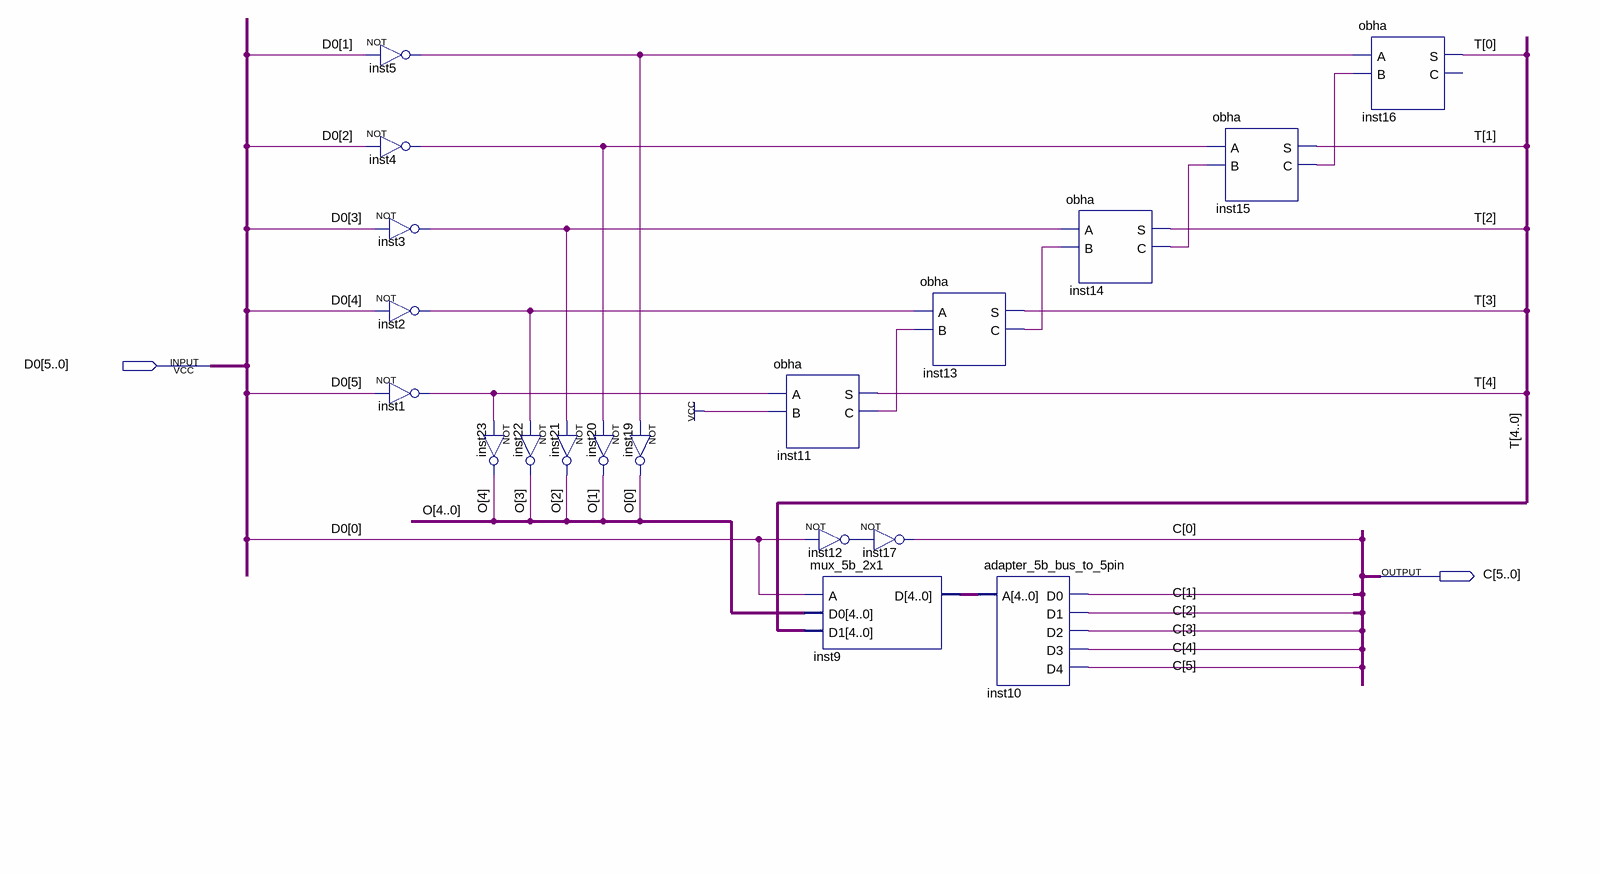
[diagram p0: schematic sheet]
// Quartus schematic cdac_6b.bdf as structural Verilog: 19 symbols, 2 pins
module cdac_6b (
  input  [5:0] D0,
  output [5:0] C
);

  wire inst1_out, inst2_out, inst3_out, inst4_out, inst5_out, inst11_c, inst12_out, inst13_c, inst14_c,
       inst15_c;
  wire [4:0] inst9_d, O, T;

  not inst5 (inst5_out, D0[1]);
  not inst4 (inst4_out, D0[2]);
  not inst3 (inst3_out, D0[3]);
  not inst2 (inst2_out, D0[4]);
  not inst1 (inst1_out, D0[5]);
  not inst22 (O[3], inst2_out);
  not inst23 (O[4], inst1_out);
  not inst20 (O[1], inst4_out);
  not inst21 (O[2], inst3_out);
  not inst19 (O[0], inst5_out);
  obha inst11 (.A(inst1_out), .B(1'b1), .S(T[4]), .C(inst11_c));
  not inst12 (inst12_out, D0[0]);
  mux_5b_2x1 inst9 (.A(D0[0]), .D0(O), .D1(T), .D(inst9_d));
  not inst17 (C[0], inst12_out);
  obha inst13 (.A(inst2_out), .B(inst11_c), .S(T[3]), .C(inst13_c));
  adapter_5b_bus_to_5pin inst10 (.A(inst9_d), .D0(C[1]), .D1(C[2]), .D2(C[3]), .D3(C[4]), .D4(C[5]));
  obha inst14 (.A(inst3_out), .B(inst13_c), .S(T[2]), .C(inst14_c));
  obha inst15 (.A(inst4_out), .B(inst14_c), .S(T[1]), .C(inst15_c));
  obha inst16 (.A(inst5_out), .B(inst15_c), .S(T[0]));  // open: C
endmodule
